# Altium schematic sheet LED_Board_control.SchDoc: LED Board
size B; Date: MM/DD/YYYY; Author: LED Team; Organization: ORGANIZATION; Address1: ADDRESS 1; Address2: ADDRESS 2; Address3: ADDRESS 3; Address4: ADDRESS 4; Revision: -; SheetNumber: 1; SheetTotal: 3; ENG_APP_DATE: --/--/--; DSN_APP_DATE: --/--/--; CHK_APP_DATE: --/--/--
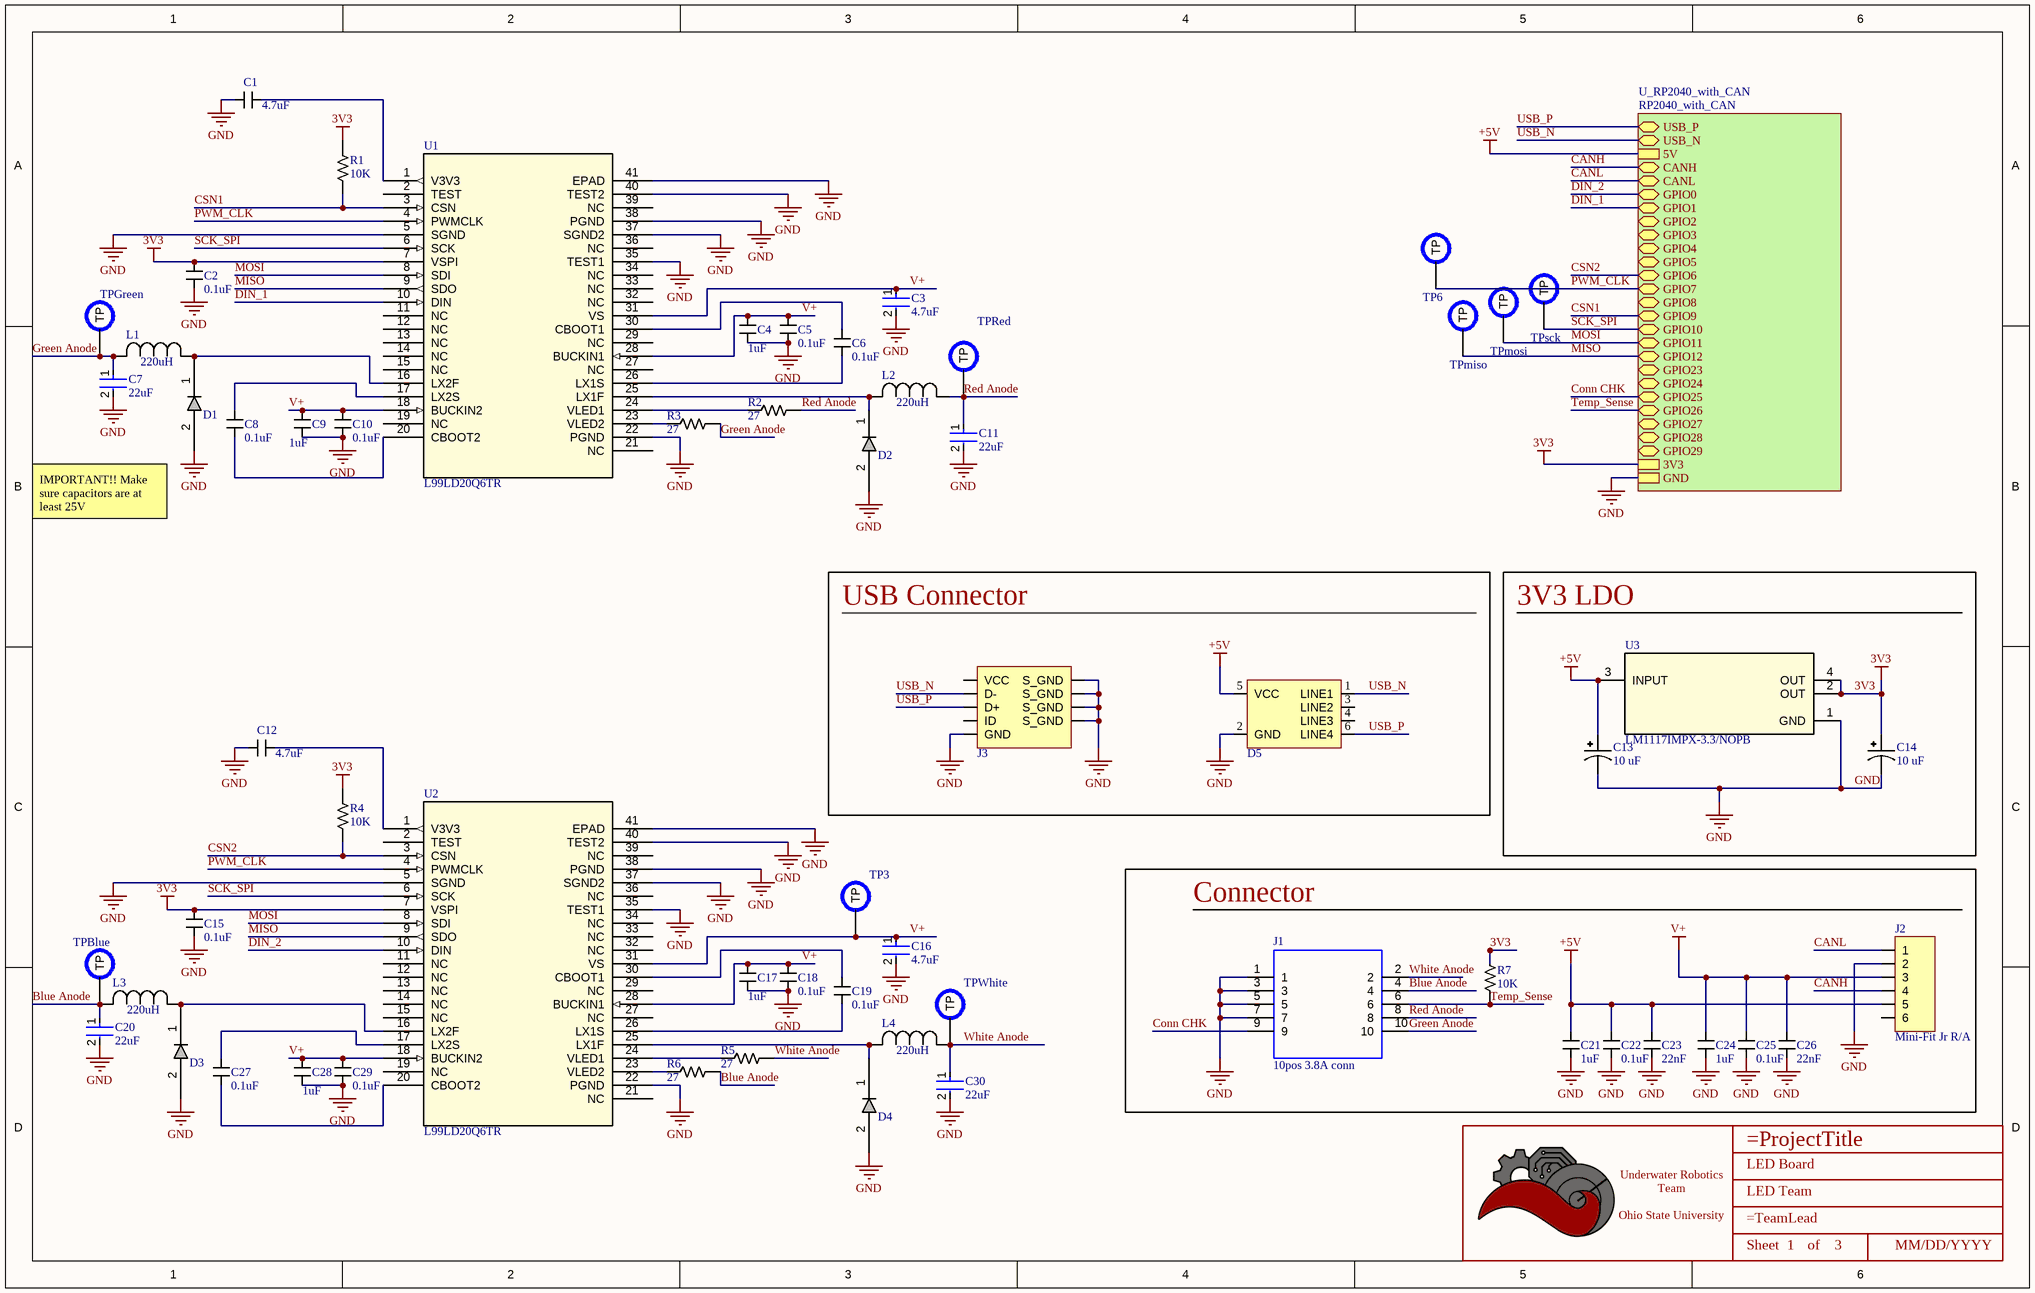
[diagram p0: LED_Board_control.SchDoc]

## Parts
*  Title_Block  [LOGO]  (value not drawn)  (graphical)
C1  value 4.7uF  [CAPACITOR_0603]  (hidden comment: 4.7uF Ceramic 6.3V)
C2  value 0.1uF  [CAPACITOR_0603]  (hidden comment: 100nF Ceramic 6.3V)
C3  4.7uF  [CAPACITOR_0603]
C4  value 1uF  [CAPACITOR_0603]  (hidden comment: 1uF Ceramic 25V)
C5  value 0.1uF  [CAPACITOR_0603]  (hidden comment: 100nF Ceramic 25V)
C6  value 0.1uF  [CAPACITOR_0603]  (hidden comment: 100nF Ceramic 25V)
C7  22uF  [FP-C2012-125-0_2-MFG]
C8  value 0.1uF  [CAPACITOR_0603]  (hidden comment: 100nF Ceramic 25V)
C9  value 1uF  [CAPACITOR_0603]  (hidden comment: 1uF Ceramic 25V)
C10  value 0.1uF  [CAPACITOR_0603]  (hidden comment: 100nF Ceramic 25V)
C11  22uF  [FP-C2012-125-0_2-MFG]
C12  value 4.7uF  [CAPACITOR_0603]  (hidden comment: 4.7uF Ceramic 6.3V)
C13  Value (uF): 10 uF  [CAPACITOR_1206 - POLAR]  (hidden comment: 10uF Tantalum 16V)
C14  Value (uF): 10 uF  [CAPACITOR_1206 - POLAR]  (hidden comment: 10uF Tantalum 16V)
C15  value 0.1uF  [CAPACITOR_0603]  (hidden comment: 100nF Ceramic 6.3V)
C16  4.7uF  [CAPACITOR_0603]
C17  value 1uF  [CAPACITOR_0603]  (hidden comment: 1uF Ceramic 25V)
C18  value 0.1uF  [CAPACITOR_0603]  (hidden comment: 100nF Ceramic 25V)
C19  value 0.1uF  [CAPACITOR_0603]  (hidden comment: 100nF Ceramic 25V)
C20  22uF  [FP-C2012-125-0_2-MFG]
C21  value 1uF  [CAPACITOR_0603]  (hidden comment: 1uF Ceramic 16V)
C22  value 0.1uF  [CAPACITOR_0805]  (hidden comment: 100nF Ceramic 50V)
C23  value 22nF  [CAPACITOR_0402]  (hidden comment: 22nF Ceramic 25V)
C24  value 1uF  [CAPACITOR_0603]  (hidden comment: 1uF Ceramic 16V)
C25  value 0.1uF  [CAPACITOR_0805]  (hidden comment: 100nF Ceramic 50V)
C26  value 22nF  [CAPACITOR_0402]  (hidden comment: 22nF Ceramic 25V)
C27  value 0.1uF  [CAPACITOR_0603]  (hidden comment: 100nF Ceramic 25V)
C28  value 1uF  [CAPACITOR_0603]  (hidden comment: 1uF Ceramic 25V)
C29  value 0.1uF  [CAPACITOR_0603]  (hidden comment: 100nF Ceramic 25V)
C30  22uF  [FP-C2012-125-0_2-MFG]
D1  CCS15S40,L3F  [SOD-963   CST2C_TOS]  (value not drawn)
D2  CCS15S40,L3F  [SOD-963   CST2C_TOS]  (value not drawn)
D3  CCS15S40,L3F  [SOD-963   CST2C_TOS]  (value not drawn)
D4  CCS15S40,L3F  [SOD-963   CST2C_TOS]  (value not drawn)
D5  TVS DIODE 5VWM 25VC SOT23-6  [SOT 23-6L]  (value not drawn)
J1  10pos 3.8A conn  [SAMTEC-LS2-105-01-X-D-RA1]
J2  Mini-Fit Jr R/A  [CONN_MOLEX_MINIFIT JR_6 POS_R/A]
J3  USB_MICRO R/A  [CONN_MINIUSB]  (value not drawn)
L1  SRR1280-221K  [IND_BOURNS_SRR1280]  (value not drawn)
L2  SRR1280-221K  [IND_BOURNS_SRR1280]  (value not drawn)
L3  SRR1280-221K  [IND_BOURNS_SRR1280]  (value not drawn)
L4  SRR1280-221K  [IND_BOURNS_SRR1280]  (value not drawn)
R1  Value  (Ohms): 10K  [RESISTOR_0402]  (hidden comment: 10k Ohm 1% 1/16W)
R2  Value  (Ohms): 27  [RESISTOR_0603]  (hidden comment: 27 Ohm 5% 1/8W)
R3  Value  (Ohms): 27  [RESISTOR_0603]  (hidden comment: 27 Ohm 5% 1/8W)
R4  Value  (Ohms): 10K  [RESISTOR_0402]  (hidden comment: 10k Ohm 1% 1/16W)
R5  Value  (Ohms): 27  [RESISTOR_0603]  (hidden comment: 27 Ohm 5% 1/8W)
R6  Value  (Ohms): 27  [RESISTOR_0603]  (hidden comment: 27 Ohm 5% 1/8W)
R7  Value  (Ohms): 10K  [RESISTOR_0603]  (hidden comment: 10k Ohm 0.5% 1/10W)
TP3  PCB Test Point  [TESTPOINT_1.2MM]  (value not drawn)  (no BOM)
TP6  PCB Test Point  [TESTPOINT_1.2MM]  (value not drawn)  (no BOM)
TPBlue  PCB Test Point  [TESTPOINT_1.2MM]  (value not drawn)  (no BOM)
TPGreen  PCB Test Point  [TESTPOINT_1.2MM]  (value not drawn)  (no BOM)
TPmiso  PCB Test Point  [TESTPOINT_1.2MM]  (value not drawn)  (no BOM)
TPmosi  PCB Test Point  [TESTPOINT_1.2MM]  (value not drawn)  (no BOM)
TPRed  PCB Test Point  [TESTPOINT_1.2MM]  (value not drawn)  (no BOM)
TPsck  PCB Test Point  [TESTPOINT_1.2MM]  (value not drawn)  (no BOM)
TPWhite  PCB Test Point  [TESTPOINT_1.2MM]  (value not drawn)  (no BOM)
U1  L99LD20Q6TR  [L99LD20Q6TR]
U2  L99LD20Q6TR  [L99LD20Q6TR]
U3  LM1117IMPX-3.3/NOPB  [SOT-223-4]

## Blocks framed on the sheet
USB Connector: D5 J3
3V3 LDO: C13 C14 U3
Connector: C21-C26 J1 J2 R7

## Sub-sheets
U_RP2040_with_CAN = RP2040_with_CAN: USB_P (bidir), USB_N (bidir), 5V, CANH (bidir), CANL (bidir), GPIO0 (bidir), GPIO1 (bidir), GPIO2 (bidir), GPIO3 (bidir), GPIO4 (bidir), GPIO5 (bidir), GPIO6 (bidir), GPIO7 (bidir), GPIO8 (bidir), GPIO9 (bidir), GPIO10 (bidir), GPIO11 (bidir), GPIO12 (bidir), GPIO23 (bidir), GPIO24 (bidir), GPIO25 (bidir), GPIO26 (bidir), GPIO27 (bidir), GPIO28 (bidir), GPIO29 (bidir), 3V3, GND

## Nets
3V3: C2.1 C14.1 C15.1 R1.1 R4.1 R7.1 U1.7(VSPI) U2.7(VSPI) U3.2(OUT) U3.4(OUT) ; sheet U_RP2040_with_CAN/3V3
+5V: C13.1 C21.1 C22.1 C23.1 D5.5(VCC) J2.5 U3.3(INPUT) ; sheet U_RP2040_with_CAN/5V
GND: C1.2 C2.2 C3.2 C4.1 C5.2 C7.2 C9.1 C10.2 C11.2 C12.2 C13.2 C14.2 C15.2 C16.2 C17.1 C18.2 C20.2 C21.2 C22.2 C23.2 C24.2 C25.2 C26.2 C28.1 C29.2 C30.2 D1.2 D2.2 D3.2 D4.2 D5.2(GND) J1.1 J1.3 J1.5 J1.7 J2.2 J3.5(GND) J3.6(S_GND) J3.7(S_GND) J3.8(S_GND) J3.9(S_GND) U1.5(SGND) U1.22(PGND) U1.35(TEST1) U1.37(SGND2) U1.38(PGND) U1.40(TEST2) U1.41(EPAD) U2.5(SGND) U2.22(PGND) U2.35(TEST1) U2.37(SGND2) U2.38(PGND) U2.40(TEST2) U2.41(EPAD) U3.1(GND) ; sheet U_RP2040_with_CAN/GND
V+: C3.1 C4.2 C5.1 C9.2 C10.1 C16.1 C17.2 C18.1 C24.1 C25.1 C26.1 C28.2 C29.1 J2.3 TP3.TP U1.18(BUCKIN2) U1.28(BUCKIN1) U1.31(VS) U2.18(BUCKIN2) U2.28(BUCKIN1) U2.31(VS)
Blue Anode: C20.1 J1.4 L3.2 R6.1 TPBlue.TP
CANH: J2.4 ; sheet U_RP2040_with_CAN/CANH
CANL: J2.1 ; sheet U_RP2040_with_CAN/CANL
Conn CHK: J1.9 ; sheet U_RP2040_with_CAN/GPIO25
CSN1: R1.2 U1.3(CSN) ; sheet U_RP2040_with_CAN/GPIO9
CSN2: R4.2 U2.3(CSN) ; sheet U_RP2040_with_CAN/GPIO6
DIN_1: U1.10(DIN) ; sheet U_RP2040_with_CAN/GPIO1
DIN_2: U2.10(DIN) ; sheet U_RP2040_with_CAN/GPIO0
Green Anode: C7.1 J1.10 L1.2 R3.1 TPGreen.TP
MISO: TPmiso.TP U1.9(SDO) U2.9(SDO) ; sheet U_RP2040_with_CAN/GPIO12
MOSI: TPmosi.TP U1.8(SDI) U2.8(SDI) ; sheet U_RP2040_with_CAN/GPIO11
PWM_CLK: TP6.TP U1.4(PWMCLK) U2.4(PWMCLK) ; sheet U_RP2040_with_CAN/GPIO7
Red Anode: C11.1 J1.8 L2.1 R2.1 TPRed.TP
SCK_SPI: TPsck.TP U1.6(SCK) U2.6(SCK) ; sheet U_RP2040_with_CAN/GPIO10
Temp_Sense: J1.6 R7.2 ; sheet U_RP2040_with_CAN/GPIO26
USB_N: D5.1(LINE1) J3.2(D-) ; sheet U_RP2040_with_CAN/USB_N
USB_P: D5.6(LINE4) J3.3(D+) ; sheet U_RP2040_with_CAN/USB_P
White Anode: C30.1 J1.2 L4.1 R5.1 TPWhite.TP
NetC1_1: C1.1 U1.1(V3V3)
NetC6_1: C6.1 U1.30(CBOOT1)
NetC6_2: C6.2 U1.26(LX1S)
NetC8_1: C8.1 U1.17(LX2S)
NetC8_2: C8.2 U1.20(CBOOT2)
NetC12_1: C12.1 U2.1(V3V3)
NetC19_1: C19.1 U2.30(CBOOT1)
NetC19_2: C19.2 U2.26(LX1S)
NetC27_1: C27.1 U2.17(LX2S)
NetC27_2: C27.2 U2.20(CBOOT2)
NetD1_1: D1.1 L1.1 U1.16(LX2F)
NetD2_1: D2.1 L2.2 U1.25(LX1F)
NetD3_1: D3.1 L3.1 U2.16(LX2F)
NetD4_1: D4.1 L4.2 U2.25(LX1F)
NetR2_2: R2.2 U1.24(VLED1)
NetR3_2: R3.2 U1.23(VLED2)
NetR5_2: R5.2 U2.24(VLED1)
NetR6_2: R6.2 U2.23(VLED2)

Not connected (* = marked no-connect by the designer): D5 3(LINE2) 4(LINE3); J2 6; J3 1(VCC) 4(ID); U1 2(TEST) 11(NC) 12(NC) 13(NC) 14(NC) 15(NC) 19(NC) 21(NC) 27(NC) 29(NC) 32(NC) 33(NC) 34(NC) 36(NC) 39(NC); U2 2(TEST) 11(NC) 12(NC) 13(NC) 14(NC) 15(NC) 19(NC) 21(NC) 27(NC) 29(NC) 32(NC) 33(NC) 34(NC) 36(NC) 39(NC)

## Notes on the sheet
- IMPORTANT!! Make sure capacitors are at least 25V
- DWG. NO.
- REV.
- SHT.
- THIS DOCUMENT AND THE DATA DISCLOSED HEREIN OR HEREWITH IS THE PROPERTY OF ALTIUM LIMITED AND MAY BE FREELY DISTRIBUTED IN WHOLE. NO RIGHTS ARE RESERVED OR EXPRESS OR IMPLIED WARANTEE GIVEN.
- REVISION
- DESCRIPTION
- DATE
- APPROVED
- ENG:
- APPROVALS
- PROJECT
- DSN:
- CHK:
- REFERENCE DOCUMENTS
- PROJECT REVISION:
- TITLE
- DOCUMENT REVISION:
- DESIGN ITEM:
- BOM:
- FAB DWG:
- PCB DWG:
- ASSY DWG:
- SCALE:
- SIZE
- B
- CAGE CODE
- FILE NAME
- DWG NO.
- SHEET
- OF
- REV
- (in symbol INDUCTOR_SRR1280-221K) 220uH
- (in symbol Title_Block) Underwater Robotics Team / Ohio State University; Sheet; of

## Library data of the parts
* = Title_Block: UWRT Schematic Title Block Template / Created June 2021, Dylan Trainor
C1 C12 = CAPACITOR_4.7uF_0603: Cap 4.7uF 6.3V +/-10% / Ceramic 0603; Made By: Robert Pafford; Tolerance: +/- 10%; Voltage: 6.3V; Supplier 1: Digi-Key; Supplier Part Number 1: 1276-2087-1-ND
C2 C15 = CAPACITOR_0.1uF_0603_1: Cap 100nF 6.3V +/-10% / Ceramic 0603; Made By: Flip B; ComponentLink1Description: Datsheet; ComponentLink1URL: https://www.mouser.com/datasheet/2/212/KEM_C1002_X7R_SMD-1102033.pdf; Tolerance: +/- 10%; Voltage: 6.3V; Supplier 1: Digi-Key; Supplier Part Number 1: 399-15351-1-ND
C3 C16 = CAP CERM 4.7UF 20% 35V: Chip Multilayer Ceramic Capacitors for General Purpose, 0603, 4.7uF, X5R, 15%, 20%, 35V; Voltage Rating (DC): 35V; Capacitance: 4.7uF; Dielectric: X5R; Case/Package: 0603; Min Operating Temperature: -55°C; Weight: 0.000222oz; Tolerance: 20%; Termination: SMD/SMT; Case Code (Imperial): 0603; Resistor Type: Ceramic; Thickness: 0.039inch; Case Code (Metric): 1608; Width: 0.8mm; Max Operating Temperature: 85°C; Mount: Surface Mount; Length: 0.063inch; Package Quantity: 4000; Height: 0.8mm; Voltage Rating: 35V; Packaging: Tape and Reel; Supplier 1: Arrow Electronics; Supplier Part Number 1: GRM188R6YA475ME15D
C4 C9 C17 C28 = CAPACITOR_1uF_0603_25V: Cap 1uF 25V +/-10% / Ceramic 0603; Voltage: 16V; Made By: Flip B; Tolerance: +/- 10%; Supplier 1: Digikey; Supplier Part Number 1: 1276-1102-1-ND
C5 C6 C8 C10 C18 C19 C27 C29 = CAPACITOR_0.1uF_0603_25V: Cap 100nF 25V +/-10% / Ceramic 0603; Voltage: 6.3V; Made By: Flip B; ComponentLink1Description: Datsheet; ComponentLink1URL: https://www.mouser.com/datasheet/2/212/KEM_C1002_X7R_SMD-1102033.pdf; Tolerance: +/- 10%; Supplier 1: Digikey; Supplier Part Number 1: 1276-1006-1-ND
C7 C11 C20 C30 = CMP-2000-06038-3: Multilayer Ceramic Capacitors 22μF ±20% 35V X5R SMD 0805; Tolerance: 20%; RoHS Compliant: Yes; Height: 1.25mm; Termination: SMD/SMT; Case/Package: 0805; Thickness: 0.057inch; Max Operating Temperature: 85°C; Min Operating Temperature: -55°C; Voltage Rating (DC): 35V; Length: 0.079inch; Dielectric: X5R; Dielectric Material: Ceramic; Capacitance: 22uF; Voltage Rating: 35V; Mount: Surface Mount; Package Quantity: 2000; Lead Free: Lead Free; Weight: 0.000194oz; REACH SVHC: No SVHC; Width: 0.049inch; Packaging: Tape and Reel; Series: C; Case Code (Metric): 2012; Case Code (Imperial): 0805
C13 C14 = CAPACITOR_10uF_1206_Tantalum_1: Cap 10uF 16V +/-20% / Tantalum 1206; Tolerance: +/- 10%; Made By: Dylan T; ComponentLink1Description: Digikey; ComponentLink1URL: https://www.digikey.com/en/products/detail/kyocera-avx/F981A106MMA/4004990; Voltage: 16V; Supplier 1: Newark; Supplier Part Number 1: 26AC4143
C21 C24 = CAPACITOR_1uF_0603: Cap 1uF 16V +/-10% / Ceramic 0603; Made By: Flip B; Tolerance: +/- 10%; Voltage: 16V; Supplier 1: Digi-Key; Supplier Part Number 1: 399-7847-1-ND
C22 C25 = CAPACITOR_0.1uF_0805: Cap 100nF 50V +/-10% / Ceramic 0805; Made By: Robert Pafford; Tolerance: +/- 10%; Voltage: 50V; Supplier 1: Newark; Supplier Part Number 1: 38AH3645
C23 C26 = CAPACITOR_0.022uF_0402: Cap 22nF 25V +/-10% / Ceramic 0402; Made By: Robert Pafford; Tolerance: +/- 10%; Voltage: 25V; Supplier 1: Digi-Key; Supplier Part Number 1: 445-1261-1-ND
D1-D4 = SCHOTTKY_40V_1.5A: DIODE SCHOTTKY 40V 1.5A CST2C; Mfr_Name: Toshiba Electronic Devices & Storage Corp.; Type: DEV; Copyright: Copyright (C) 2023 Ultra Librarian. All rights reserved.; Manufacturer_Part_Number: CCS15S40,L3F; RefDes: RefDes; Supplier 1: Digi-Key; Supplier Part Number 1: CCS15S40L3FCT-ND
D5 = RCLAMP0504S.TCT: 25V Clamp 6A (8/20µs) Ipp Tvs Diode Surface Mount SOT-23-6; Made By: Robert Pafford; Reverse Standoff Voltage (Typ): 5V; Breakdown Voltage (Min): 6V; Supplier 1: Digi-Key; Supplier Part Number 1: RCLAMP0504SCT-ND; Clamping Voltage (Max): 25V
J1 = SAMTEC-LS2-105-01-X-D-RA1: 10 Position Connector Self Mating, Non-Gendered, Hermaphroditic Through Hole, Right Angle Gold; Price: None; Value: *; Package: None; MP: SAMTEC-LS2-105-01-X-D-RA1; Availability: Unavailable; Supplier 1: Mouser; Supplier Part Number 1: 200-LS210501FDRA1
J2 = CONN_MOLEX_MINIFIT JR_6POS_R/A: Molex Minifit Jr. 5569 / 6 Pos R/A Natural; Pitch: 4.2mm; Configuration: Right Angle; Current Per Pin: 13A; Number of Positions: 8; Manufacturer: Molex; Color: Natural; Created By: Flip B; ComponentLink1Description: Datasheet; ComponentLink1URL: https://www.molex.com/pdm_docs/ps/PS-5556-001.pdf; Series: Minifit Jr 5569; Supplier 1: Digi-Key; Supplier Part Number 1: WM1353-ND
J3 = CONN_MICROUSB: Amphenol Micro USB-B / USB2.0 5 Pin Right Angle SMD; Pitch: 0.65mm; Current Per Pin: 1.8A; Number of Positions: 5; Manufacturer: Amphenol; Configuration: Right Angle; Color: Silver; Created By: Flip B; ComponentLink1Description: Datasheet; ComponentLink1URL: https://cdn.amphenol-icc.com/media/wysiwyg/files/documentation/datasheet/inputoutput/io_usb_micro.pdf?__cf_chl_jschl_tk__=05693735e19256298f6ef6ca2bb2e65c376a4f56-1625503833-0-Abitsb0-ufjOXJYs_S3J3r2iTn-nObalbmXUksF1VvO_h_WEmRdMlUD1I8-hmWSEVWzY1pirKnrPZWfgY3851qyBZe5ZvnNQePLGIzUgdEIQBVUyW36RsbYpDLEWxJ4horD-5gChFgobLYqwmG5aHl0E8lIn_twwPPrOxilK2gP0q9t_CNOs_u5fMqXvXUrlsOv8tIE2NRlu6NVP8qtkL2GjhlkeTUbDMF8WvvpPDTFOgvZ4Y16Ej8F8AhWos88mo5B1HssXozw0XrkJQIqERITUu6rqloz9kf4ZzhBHtDAt-IkiAFY_Ds9SW8FYKKTtINJVpHZQ6Gyu1FFM4Dc9MO0maE8_mmNcwlxqyRoRk_MPWW8VyByXWM5RSp52jteRKw7FeI9WIYvCbPAOy0Eyib-aseIQsnGbglBcUY6_2xp8GYaJM38H3dNvBPsSOfJBPndKedwKHllxjkucXn6xsN0sDXkpGN-cu8_2bDTJ0g-uUucKSCooYX-ApSDNGpkA_p9zv1SOAD8c0zaZVmtiBsN75QpVz2rzq9_BFxOywPvR; Series: 10118192; Supplier 1: Digi-Key; Supplier Part Number 1: 609-4613-1-ND
L1-L4 = INDUCTOR_SRR1280-221K: 220 µH Shielded Drum Core, Wirewound Inductor 1.6 A 400mOhm Max Nonstandard; Mfr_Name: Bourns Electronics; Type: DEV; Copyright: Copyright (C) 2023 Ultra Librarian. All rights reserved.; Manufacturer_Part_Number: SRR1280-221K; RefDes: RefDes; Supplier 1: Digi-Key; Supplier Part Number 1: SRR1280-221KLCT-ND
R1 R4 = RESISTOR_10K_0402: RES 10k OHM 1% 1/16W 0402; Tolerance: +/- 1%; Made By: Robert Pafford; Wattage: 1/16W; Supplier: Digikey; Digikey Part Numer: CR0603-JW-104ELFTR-ND; Supplier 1: Digi-Key; Supplier Part Number 1: YAG3436CT-ND
R2 R3 R5 R6 = RESISTOR_27_0603: RES 27 OHM 5% 1/8W 0603; Tolerance: +/- 5%; Made By: Robert Pafford; ComponentLink1Description: Datasheet; ComponentLink1URL: https://www.bourns.com/docs/product-datasheets/CRxxxxx.pdf; Wattage: 1/8W; Supplier: Digikey; Digikey Part Numer: CR0603-JW-104ELFTR-ND; Supplier 1: Digi-Key; Supplier Part Number 1: 2019-RK73B1JTTD270JCT-ND
R7 = RESISTOR_10K_0.5%_0603: RES 10k OHM 0.5% 1/10W 0603; Tolerance: +/- 0.5%; Made By: Robert Pafford; Wattage: 1/10W; Supplier: Digikey; Digikey Part Numer: CR0603-JW-104ELFTR-ND; Supplier 1: Digi-Key; Supplier Part Number 1: 749-1695-1-ND
TP3 TP6 TPBlue TPGreen TPmiso TPmosi TPRed TPsck TPWhite = TESTPOINT: Made By: Robert Pafford
U1 U2 = L99LD20Q6TR: IC LED DRVR RGLTR PWM 1.5A 40QFN; Mfr_Name: STMicroelectronics; Copyright: Copyright (C) 2023 Ultra Librarian. All rights reserved.; Manufacturer_Part_Number: L99LD20Q6TR; RefDes: RefDes; Type: DEV; Supplier 1: Digi-Key; Supplier Part Number 1: 497-18126-1-ND
U3 = LM1117IMPX-3.3/NOPB: IC REG LIN 3.3V 800MA SOT223-4; PartNumber: LM1117IMP-3.3/NOPB; Manufacturer: Texas Instruments; Vin (Max): 15V; Supplier 1: Digi-Key; Supplier Part Number 1: LM1117IMPX-3.3/NOPBCT-ND; Vout (Min/Fixed): 3.3V; Amp Out: 800mA; Package: SOT-223-4; Created By: Dylan T